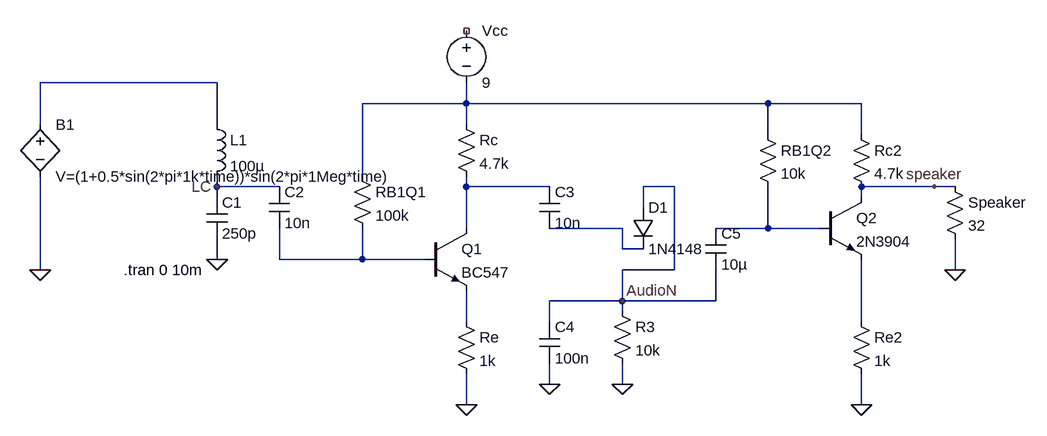
[diagram p0: schematic NetListRadioAMGemini.asc]
NetListRadioAMGemini.asc, the LTspice schematic file:
Version 4.1
SHEET 1 1540 680
WIRE 288 -80 16 -80
WIRE 672 -48 672 -80
WIRE 672 -48 512 -48
WIRE 1136 -48 672 -48
WIRE 1280 -48 1136 -48
WIRE 16 -16 16 -80
WIRE 288 -16 288 -80
WIRE 672 -16 672 -48
WIRE 1136 0 1136 -48
WIRE 1280 0 1280 -48
WIRE 512 64 512 -48
WIRE 288 80 288 64
WIRE 384 80 288 80
WIRE 672 80 672 64
WIRE 800 80 672 80
WIRE 992 80 944 80
WIRE 1392 80 1280 80
WIRE 1424 80 1392 80
WIRE 288 96 288 80
WIRE 1280 96 1280 80
WIRE 944 112 944 80
WIRE 672 144 672 80
WIRE 912 144 800 144
WIRE 1136 144 1136 80
WIRE 1136 144 1056 144
WIRE 1216 144 1136 144
WIRE 912 176 912 144
WIRE 944 176 912 176
WIRE 288 192 288 160
WIRE 384 192 384 144
WIRE 512 192 512 144
WIRE 512 192 384 192
WIRE 608 192 512 192
WIRE 16 208 16 64
WIRE 992 208 992 80
WIRE 992 208 912 208
WIRE 1424 208 1424 160
WIRE 912 256 912 208
WIRE 912 256 800 256
WIRE 1056 256 1056 208
WIRE 1056 256 912 256
WIRE 912 272 912 256
WIRE 672 288 672 240
WIRE 800 288 800 256
WIRE 1280 288 1280 192
WIRE 800 384 800 352
WIRE 912 384 912 352
WIRE 672 416 672 368
WIRE 1280 416 1280 368
FLAG 16 208 0
FLAG 288 192 0
FLAG 672 416 0
FLAG 912 256 AudioN
FLAG 800 384 0
FLAG 912 384 0
FLAG 1280 416 0
FLAG 1424 208 0
FLAG 288 80 LC
FLAG 1392 80 speaker
SYMBOL bv 16 -32 R0
SYMATTR InstName B1
SYMATTR Value V=(1+0.5*sin(2*pi*1k*time))*sin(2*pi*1Meg*time)
SYMBOL ind 272 -32 R0
SYMATTR InstName L1
SYMATTR Value 100µ
SYMBOL cap 272 96 R0
SYMATTR InstName C1
SYMATTR Value 250p
SYMBOL npn 608 144 R0
SYMATTR InstName Q1
SYMATTR Value BC547
SYMBOL res 656 -32 R0
SYMATTR InstName Rc
SYMATTR Value 4.7k
SYMBOL res 656 272 R0
SYMATTR InstName Re
SYMATTR Value 1k
SYMBOL voltage 672 -176 R0
SYMATTR InstName Vcc
SYMATTR Value 9
SYMBOL cap 784 80 R0
SYMATTR InstName C3
SYMATTR Value 10n
SYMBOL res 896 256 R0
SYMATTR InstName R3
SYMATTR Value 10k
SYMBOL cap 784 288 R0
SYMATTR InstName C4
SYMATTR Value 100n
SYMBOL npn 1216 96 R0
SYMATTR InstName Q2
SYMATTR Value 2N3904
SYMBOL res 1264 -16 R0
SYMATTR InstName Rc2
SYMATTR Value 4.7k
SYMBOL res 1264 272 R0
SYMATTR InstName Re2
SYMATTR Value 1k
SYMBOL res 1408 64 R0
SYMATTR InstName Speaker
SYMATTR Value 32
SYMBOL cap 368 80 R0
SYMATTR InstName C2
SYMATTR Value 10n
SYMBOL res 496 48 R0
SYMATTR InstName RB1Q1
SYMATTR Value 100k
SYMBOL cap 1040 144 R0
SYMATTR InstName C5
SYMATTR Value 10µ
SYMBOL res 1120 -16 R0
SYMATTR InstName RB1Q2
SYMATTR Value 10k
SYMBOL diode 928 112 R0
SYMATTR InstName D1
SYMATTR Value 1N4148
TEXT 144 208 Left 2 !.tran 0 10m

The netlist it stands for:
* NetListRadioAMGemini.asc
B1 N001 0 V=(1+0.5*sin(2*pi*1k*time))*sin(2*pi*1Meg*time)
L1 N001 LC 100µ
C1 LC 0 250p
Q1 N003 N006 N007 0 BC547
Rc N002 N003 4.7k
Re N007 0 1k
Vcc NC_01 N002 9
C3 N003 N004 10n
R3 AudioN 0 10k
C4 AudioN 0 100n
Q2 speaker N005 N008 0 2N3904
Rc2 N002 speaker 4.7k
Re2 N008 0 1k
R§Speaker speaker 0 32
C2 LC N006 10n
RB1Q1 N002 N006 100k
C5 N005 AudioN 10µ
RB1Q2 N002 N005 10k
D1 AudioN N004 1N4148
.model D D
.lib standard.dio
.model NPN NPN
.model PNP PNP
.lib standard.bjt
.tran 0 10m
.backanno
.end